# Altium schematic sheet 06 POWER.SchDoc
size 420 x 297 mm; Organization: Altium Limited; Address1: L3, 12a Rodborough Rd; Address2: Frenchs Forest; Address3: NSW; Address4: Australia 2086
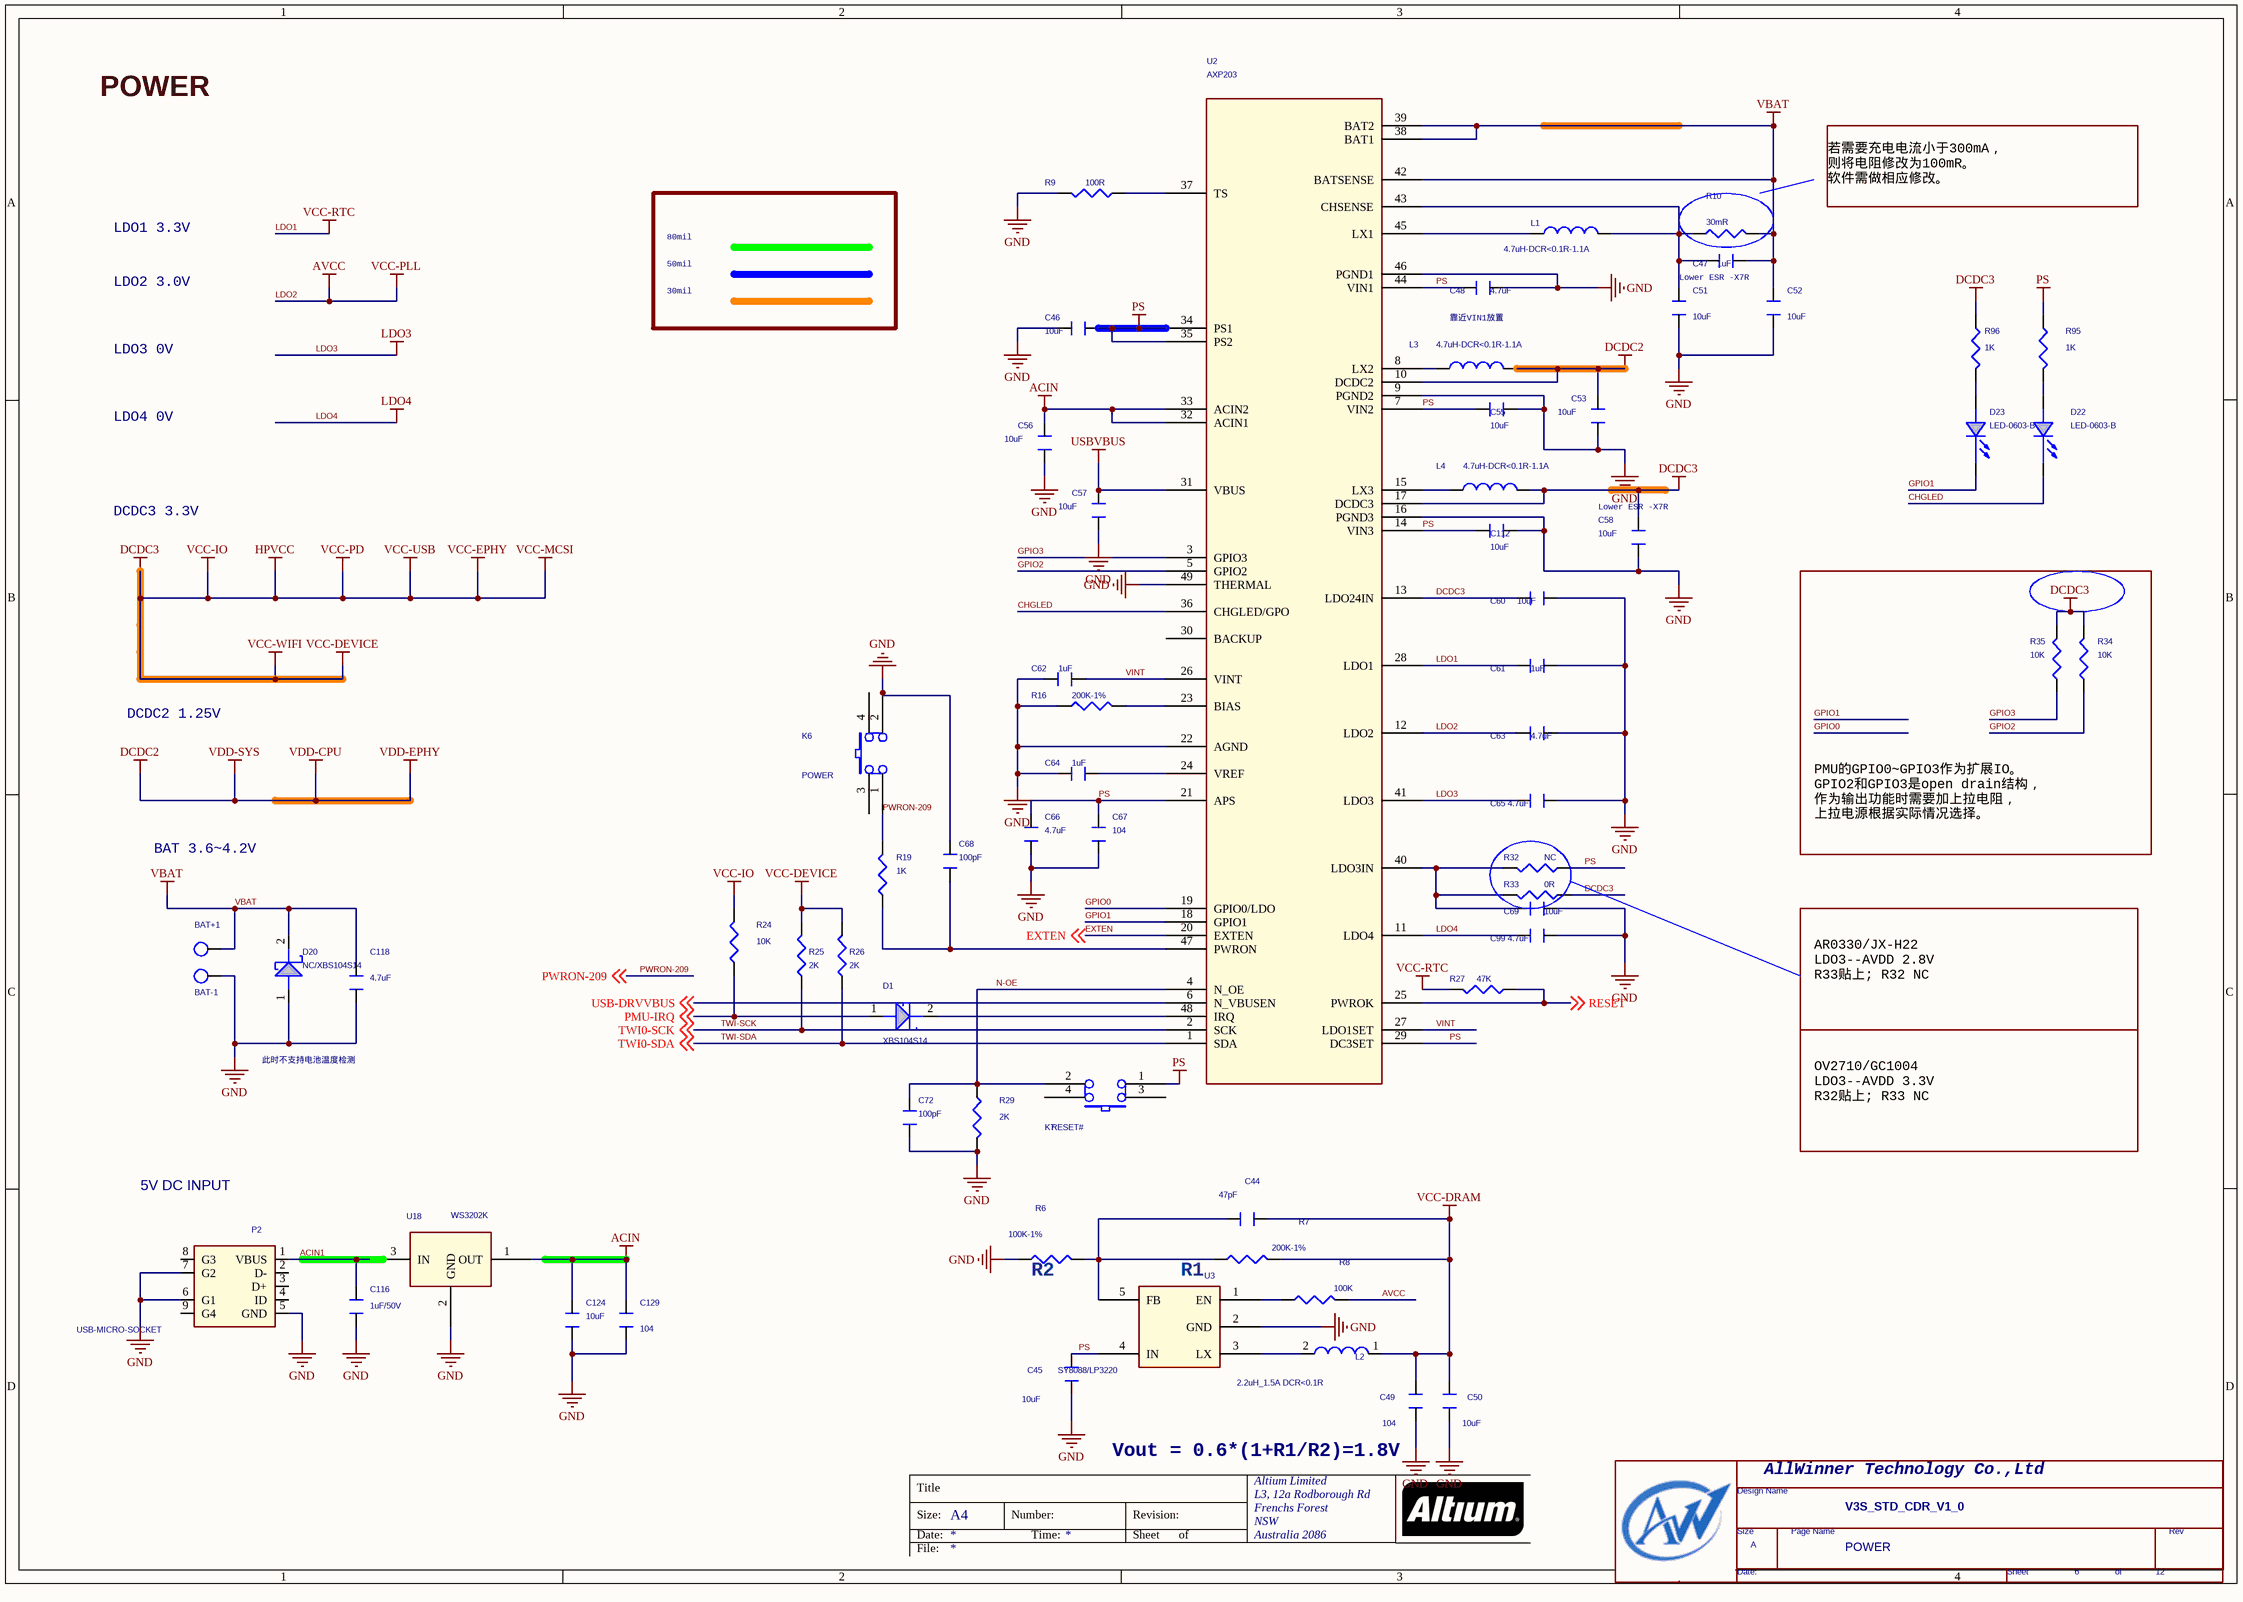
[diagram p0: 06 POWER.SchDoc]

## Parts
*  Page Count: 12  Page Number: 6  Page Size: A  Title: V3S_STD_CDR_V1_0  Doc: POWER  (hidden comment: TitleBlock0-AW)  (graphical)
BAT+1  VCC-3V  [BAT_SMD]  (value not drawn)
BAT-1  VCC-3V  [BAT_SMD]  (value not drawn)
C44  47pF  [C0402]
C45  10uF  [C0603]
C46  10uF  [C0603]
C47  1uF  [C0402]
C48  4.7uF  [C0402]
C49  104  [C0402]
C50  10uF  [C0603]
C51  10uF  [C0603]
C52  10uF  [C0603]
C53  10uF  [C0603]
C55  10uF  [C0603]
C56  10uF  [C0603]
C57  10uF  [C0603]
C58  10uF  [C0603]
C60  10uF  [C0603]
C61  1uF  [C0402]
C62  1uF  [C0402]
C63  4.7uF  [C0402]
C64  1uF  [C0402]
C65  4.7uF  [C0402]
C66  4.7uF  [C0402]
C67  104  [C0402]
C68  100pF  [C0402]
C69  10uF  [C0603]
C72  100pF  [C0402]
C99  4.7uF  [C0402]
C112  10uF  [C0603]
C116  1uF/50V  [C0603]
C118  4.7uF  [C0402]
C124  10uF  [C0603]
C129  104  [C0402]
D1  XBS104S14  [SOD123]
D20  NC/XBS104S14  [SOD123]
D22  LED-0603-B  [0805]
D23  LED-0603-B  [0805]
K6  POWER  [SW4]
K7  RESET#  [SW4]
L1  4.7uH-DCR<0.1R-1.1A  [CD32]
L2  2.2uH_1.5A DCR<0.1R  [CD32]
L3  4.7uH-DCR<0.1R-1.1A  [CD32]
L4  4.7uH-DCR<0.1R-1.1A  [CD32]
P2  USB-MICRO-SOCKET  [USB_MINI_AB]
R6  100K-1%  [R0402]
R7  200K-1%  [R0402]
R8  100K  [R0402]
R9  100R  [R0402]
R10  30mR  [R0603]
R16  200K-1%  [R0402]
R19  1K  [R0402]
R24  10K  [R0402]
R25  2K  [R0402]
R26  2K  [R0402]
R27  47K  [R0402]
R29  2K  [R0402]
R32  NC  [R0402]
R33  0R  [R0402]
R34  10K  [R0402]
R35  10K  [R0402]
R95  1K  [R0402]
R96  1K  [R0402]
U2  AXP203  [QFN48]
U3  SY8088/LP3220  [TSOT-23-6]
U18  WS3202K  [SOT-89-3L]

## Nets
ACIN: C56.1 C124.1 C129.2 U2.32(ACIN1) U2.33(ACIN2) U18.1(OUT)
AVCC: C63.1 R8.1 U2.12(LDO2)  [also labelled LDO2, VCC-PLL]
DCDC2: C53.1 L3.2 U2.10(DCDC2)  [also labelled VDD-CPU, VDD-EPHY, VDD-SYS]
DCDC3: C58.1 C60.1 L4.2 R24.2 R25.2 R26.2 R33.1 R34.2 R35.2 R96.1 U2.13(LDO24IN) U2.17(DCDC3)  [also labelled HPVCC, VCC-DEVICE, VCC-EPHY, VCC-IO, VCC-MCSI, VCC-PD, VCC-USB, VCC-WIFI]
GND: BAT-1.1(TP) C45.2 C46.1 C48.2 C49.2 C50.2 C51.2 C52.2 C53.2 C55.2 C56.2 C57.2 C58.2 C60.2 C61.1 C62.2 C63.2 C64.1 C65.1 C66.2 C67.1 C68.1 C69.2 C72.2 C99.1 C112.2 C116.1 C118.1 C124.2 C129.1 D20.1 K6.2 P2.5(GND) P2.6(G1) P2.7(G2) R6.2 R9.2 R16.1 R29.2 U2.9(PGND2) U2.16(PGND3) U2.22(AGND) U2.46(PGND1) U2.49(THERMAL) U3.2(GND) U18.2(GND)
LDO1: C61.2 R27.2 U2.28(LDO1)  [also labelled VCC-RTC]
LDO3: C65.2 U2.41(LDO3)
LDO4: C99.2 U2.11(LDO4)
PS: C45.1 C46.2 C48.1 C55.1 C66.1 C67.2 C112.1 K7.1 R32.1 R95.1 U2.7(VIN2) U2.14(VIN3) U2.21(APS) U2.29(DC3SET) U2.34(PS1) U2.35(PS2) U2.44(VIN1) U3.4(IN)
USBVBUS: C57.1 U2.31(VBUS)
VBAT: BAT+1.1(TP) C47.2 C52.1 C118.2 D20.2 R10.1 U2.38(BAT1) U2.39(BAT2) U2.42(BATSENSE)
VCC-DRAM: C44.1 C49.1 C50.1 L2.1 R7.1
ACIN1: C116.2 P2.1(VBUS) U18.3(IN)
CHGLED: D22.2(CATHODE) U2.36(CHGLED/GPO)
EXTEN: U2.20(EXTEN) ; off-sheet EXTEN
GPIO0: U2.19(GPIO0/LDO)
GPIO1: D23.2(CATHODE) U2.18(GPIO1)
GPIO2: R34.1 U2.5(GPIO2)
GPIO3: R35.1 U2.3(GPIO3)
N-OE: C72.1 K7.2 R29.1 U2.4(N_OE)
PMU-IRQ: D1.1 R24.1 ; off-sheet PMU-IRQ
PWRON-209: K6.1 R19.2 ; off-sheet PWRON-209
RESET: R27.1 U2.25(PWROK) ; off-sheet RESET
TWI-SCK: R25.1 U2.2(SCK) ; off-sheet TWI0-SCK  [also labelled TWI0-SCK]
TWI-SDA: R26.1 U2.1(SDA) ; off-sheet TWI0-SDA  [also labelled TWI0-SDA]
USB-DRVVBUS: U2.6(N_VBUSEN) ; off-sheet USB-DRVVBUS
VINT: C62.1 U2.26(VINT) U2.27(LDO1SET)
NetC44_2: C44.2 R6.1 R7.2 U3.5(FB)
NetC47_1: C47.1 C51.1 L1.1 R10.2 U2.43(CHSENSE)
NetC64_2: C64.2 U2.24(VREF)
NetC68_2: C68.2 R19.1 U2.47(PWRON)
NetC69_1: C69.1 R32.2 R33.2 U2.40(LDO3IN)
NetD1_2: D1.2 U2.48(IRQ)
NetD22_1: D22.1(ANODE) R95.2
NetD23_1: D23.1(ANODE) R96.2
NetL1_2: L1.2 U2.45(LX1)
NetL2_2: L2.2 U3.3(LX)
NetL3_1: L3.1 U2.8(LX2)
NetL4_1: L4.1 U2.15(LX3)
NetR8_2: R8.2 U3.1(EN)
NetR9_1: R9.1 U2.37(TS)
NetR16_2: R16.2 U2.23(BIAS)

Not connected (* = marked no-connect by the designer): K6 3 4; K7 3 4; P2 2(D-) 3(D+) 4(ID) 8(G3) 9(G4); U2 30(BACKUP)

## Notes on the sheet
- POWER
- 若需要充电电流小于300mA，
  则将电阻修改为100mR。
  软件需做相应修改。
- LDO1 3.3V
- 80mil
- LDO2 3.0V
- 50mil
- 30mil
- 靠近VIN1放置
- Lower ESR -X7R
- LDO3 0V
- LDO4 0V
- DCDC3 3.3V
- (near C58) Lower ESR -X7R
- DCDC2 1.25V
- BAT 3.6~4.2V
- PMU的GPIO0~GPIO3作为扩展IO。
  GPIO2和GPIO3是open drain结构，
  作为输出功能时需要加上拉电阻，
  上拉电源根据实际情况选择。
- AR0330/JX-H22
  LDO3--AVDD 2.8V
  R33贴上; R32 NC
- 此时不支持电池温度检测
- OV2710/GC1004
  LDO3--AVDD 3.3V
  R32贴上; R33 NC
- 5V DC INPUT
- (near R6) R2           R1
- Vout = 0.6*(1+R1/R2)=1.8V
- Title
- Size:
- Date:
- A4
- Number:
- Time:
- Revision:
- Sheet
- of
- File:
- (in symbol TitleBlock0-AW) AllWinner Technology Co.,Ltd; Design Name; Size; Page Name; Rev; Date:; Sheet; of

## Library data of the parts
BAT+1 BAT-1 = T_POINT_R: Page: 7
C44 C49 = CAPACITOR_1: ROOM: DCDC; PAGE: 5
C45 = CAPACITOR_3: PAGE: 5; ROOM: DCDC
C46 C48 C55-C58 C61-C67 C99 C112 C116 = CAPACITOR_0_Dup2: PAGE: 1; ROOM: PMU
C47 C51-C53 C60 C69 = CAPACITOR_0_Dup2: ROOM: PMU; PAGE: 1
C50 = CAPACITOR_3: ROOM: DCDC; PAGE: 5
C68 = CAPACITOR_1: Page: 7; ROOM: PMU
C72 = CAPACITOR_1: ROOM: PMU; Page: 7
C118 C129 = CAPACITOR_Dup1: Page: 7
C124 = CAPACITOR_3: PAGE: 1
D1 = DIODE SCHOTTKY_0: RoHS 1.0 Ampere Schottky Barrier Rectifiers  SOD-123; Page: 7; ROOM: PMU
D20 = DIODE_SCHOTTKY: Page: 7
D22 D23 = LED: Page: 7
K6 = SW_PUSH_1: SDTSourceLibName: C:\WIND95\TEMP\6200.LIB; Page: 7
K7 = SW_PUSH_0: SDTSourceLibName: C:\WIND95\TEMP\6200.LIB; Page: 7
L1 L3 L4 = INDUCTOR_1: ROOM: PMU
L2 = INDUCTOR_Dup1: ROOM: DCDC; PAGE: 5
P2 = USB_MINI_SOCKET_2
R6 R8 = R_Dup4: ROOM: DCDC; PAGE: 5
R7 = R_Dup4: PAGE: 5; ROOM: DCDC
R9 R16 R27 R29 = R_Dup4: ROOM: PMU
R10 = R_Dup2: ROOM: PMU; PAGE: 1
R19 = R_Dup3: Page: 7; ROOM: PMU
R24 R33 R34 = R_Dup4: Page: 7; ROOM: PMU
R25 R26 R32 R35 = R_Dup4: ROOM: PMU; Page: 7
R95 R96 = R_Dup4
U2 = AW1612_0: ROOM: PMU
U3 = RT9293B_0: PAGE: 5; ROOM: DCDC
U18 = WS3202K_0
* = TitleBlock0-AW: Page Create Date: March  8, 1995